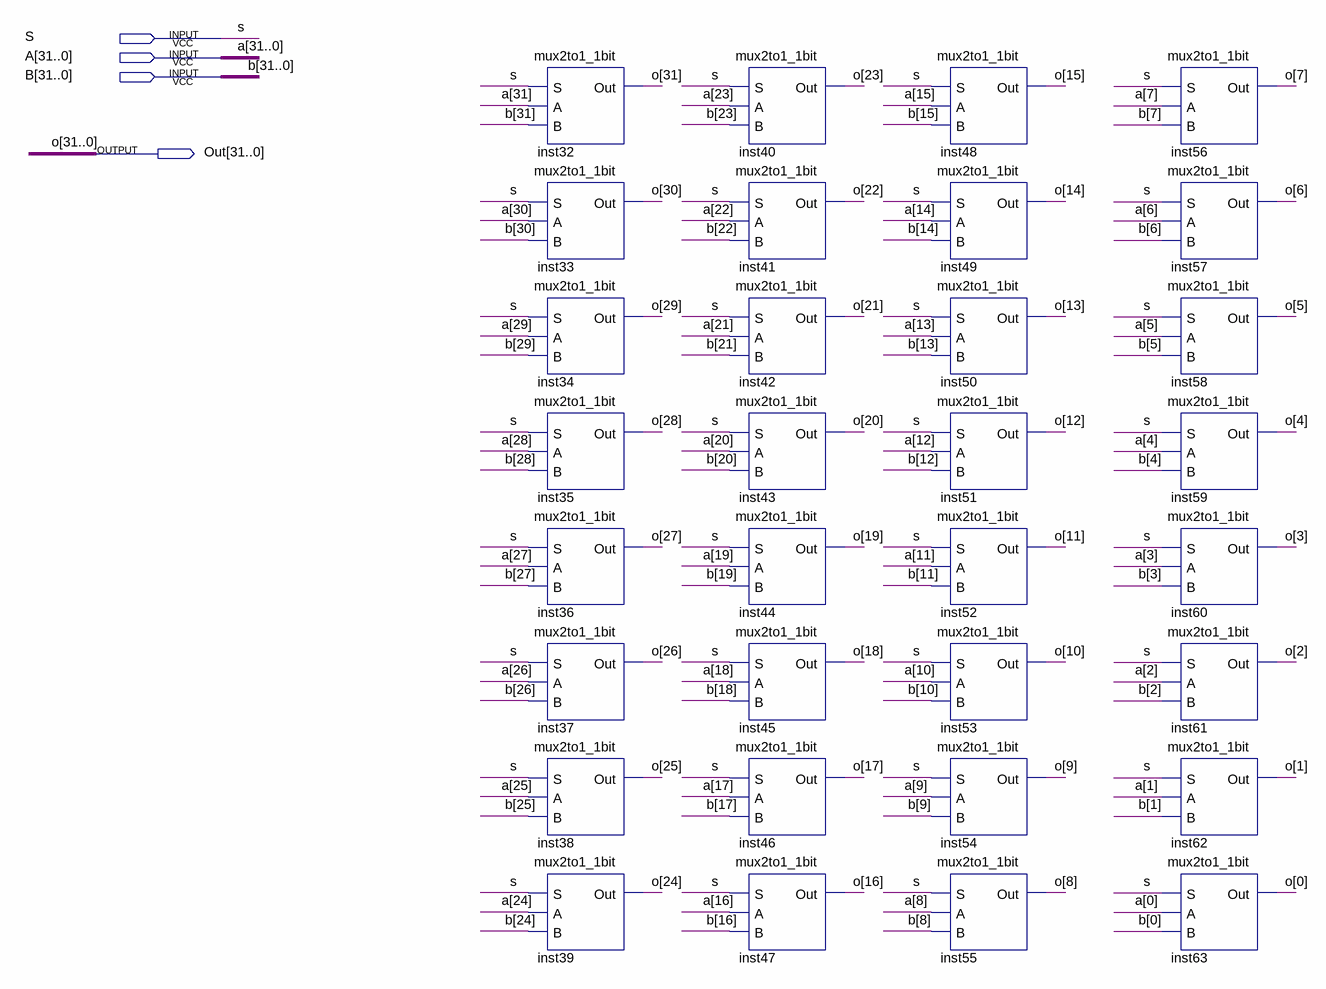
[diagram p0: schematic sheet]
// Quartus schematic MUX2TO1_32BIT.bdf as structural Verilog: 32 symbols, 4 pins
module MUX2TO1_32BIT (
  input  S,
  input  [31:0] A,
  input  [31:0] B,
  output [31:0] Out
);

  mux2to1_1bit inst32 (.S(S), .A(A[31]), .B(B[31]), .Out(Out[31]));
  mux2to1_1bit inst33 (.S(S), .A(A[30]), .B(B[30]), .Out(Out[30]));
  mux2to1_1bit inst34 (.S(S), .A(A[29]), .B(B[29]), .Out(Out[29]));
  mux2to1_1bit inst35 (.S(S), .A(A[28]), .B(B[28]), .Out(Out[28]));
  mux2to1_1bit inst36 (.S(S), .A(A[27]), .B(B[27]), .Out(Out[27]));
  mux2to1_1bit inst37 (.S(S), .A(A[26]), .B(B[26]), .Out(Out[26]));
  mux2to1_1bit inst38 (.S(S), .A(A[25]), .B(B[25]), .Out(Out[25]));
  mux2to1_1bit inst39 (.S(S), .A(A[24]), .B(B[24]), .Out(Out[24]));
  mux2to1_1bit inst40 (.S(S), .A(A[23]), .B(B[23]), .Out(Out[23]));
  mux2to1_1bit inst41 (.S(S), .A(A[22]), .B(B[22]), .Out(Out[22]));
  mux2to1_1bit inst42 (.S(S), .A(A[21]), .B(B[21]), .Out(Out[21]));
  mux2to1_1bit inst43 (.S(S), .A(A[20]), .B(B[20]), .Out(Out[20]));
  mux2to1_1bit inst44 (.S(S), .A(A[19]), .B(B[19]), .Out(Out[19]));
  mux2to1_1bit inst45 (.S(S), .A(A[18]), .B(B[18]), .Out(Out[18]));
  mux2to1_1bit inst46 (.S(S), .A(A[17]), .B(B[17]), .Out(Out[17]));
  mux2to1_1bit inst47 (.S(S), .A(A[16]), .B(B[16]), .Out(Out[16]));
  mux2to1_1bit inst48 (.S(S), .A(A[15]), .B(B[15]), .Out(Out[15]));
  mux2to1_1bit inst49 (.S(S), .A(A[14]), .B(B[14]), .Out(Out[14]));
  mux2to1_1bit inst50 (.S(S), .A(A[13]), .B(B[13]), .Out(Out[13]));
  mux2to1_1bit inst51 (.S(S), .A(A[12]), .B(B[12]), .Out(Out[12]));
  mux2to1_1bit inst52 (.S(S), .A(A[11]), .B(B[11]), .Out(Out[11]));
  mux2to1_1bit inst53 (.S(S), .A(A[10]), .B(B[10]), .Out(Out[10]));
  mux2to1_1bit inst54 (.S(S), .A(A[9]), .B(B[9]), .Out(Out[9]));
  mux2to1_1bit inst55 (.S(S), .A(A[8]), .B(B[8]), .Out(Out[8]));
  mux2to1_1bit inst56 (.S(S), .A(A[7]), .B(B[7]), .Out(Out[7]));
  mux2to1_1bit inst57 (.S(S), .A(A[6]), .B(B[6]), .Out(Out[6]));
  mux2to1_1bit inst58 (.S(S), .A(A[5]), .B(B[5]), .Out(Out[5]));
  mux2to1_1bit inst59 (.S(S), .A(A[4]), .B(B[4]), .Out(Out[4]));
  mux2to1_1bit inst60 (.S(S), .A(A[3]), .B(B[3]), .Out(Out[3]));
  mux2to1_1bit inst61 (.S(S), .A(A[2]), .B(B[2]), .Out(Out[2]));
  mux2to1_1bit inst62 (.S(S), .A(A[1]), .B(B[1]), .Out(Out[1]));
  mux2to1_1bit inst63 (.S(S), .A(A[0]), .B(B[0]), .Out(Out[0]));

  // Other names for the same wires on the sheet: o[31:0] = Out
endmodule
